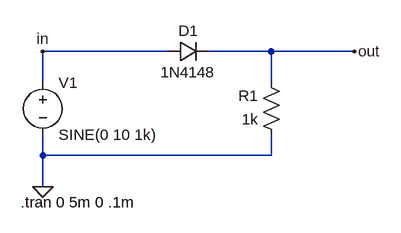
[diagram p0: schematic Sim_1_2.asc]
Sim_1_2.asc, the LTspice schematic file:
Version 4
SHEET 1 880 680
WIRE 16 -80 -176 -80
WIRE 176 -80 80 -80
WIRE 304 -80 176 -80
WIRE -176 -32 -176 -80
WIRE 176 -32 176 -80
WIRE -176 80 -176 48
WIRE 176 80 176 48
WIRE 176 80 -176 80
WIRE -176 128 -176 80
FLAG -176 128 0
FLAG -176 -80 in
FLAG 304 -80 out
SYMBOL voltage -176 -48 R0
WINDOW 123 0 0 Left 0
WINDOW 39 0 0 Left 0
SYMATTR InstName V1
SYMATTR Value SINE(0 10 1k)
SYMBOL res 192 64 R180
WINDOW 0 36 76 Left 2
WINDOW 3 36 40 Left 2
SYMATTR InstName R1
SYMATTR Value 1k
SYMBOL diode 16 -64 R270
WINDOW 0 32 32 VTop 2
WINDOW 3 0 32 VBottom 2
SYMATTR InstName D1
SYMATTR Value 1N4148
TEXT -210 152 Left 2 !.tran 0 5m 0 .1m

The netlist it stands for:
* Sim_1_2.asc
V1 in 0 SINE(0 10 1k)
R1 0 out 1k
D1 in out 1N4148
.model D D
.lib standard.dio
.tran 0 5m 0 .1m
.backanno
.end

* Results of the author's LTspice run, read from the files saved beside the schematic
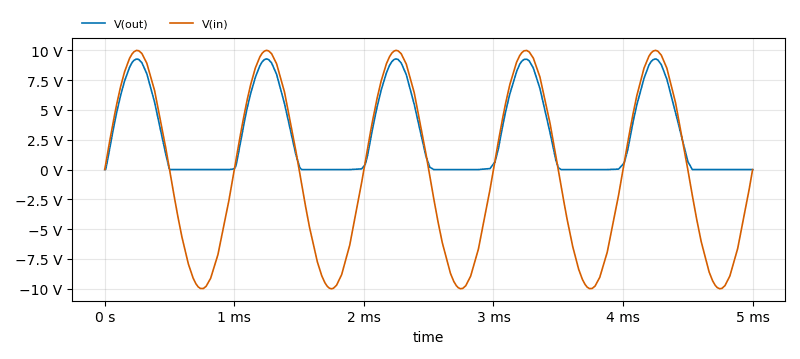
[diagram p1: Transient Analysis of Sim_1_2.asc, plotted from the saved traces]
* Transient Analysis, 1 run:
*   V(out): min -225.5 µV, max 9.284 V, average 2.835 V, rms 4.533 V, last 202.1 µV
*   V(in): min -10 V, max 9.999 V, average 2.499 mV, rms 7.103 V, last 0 V